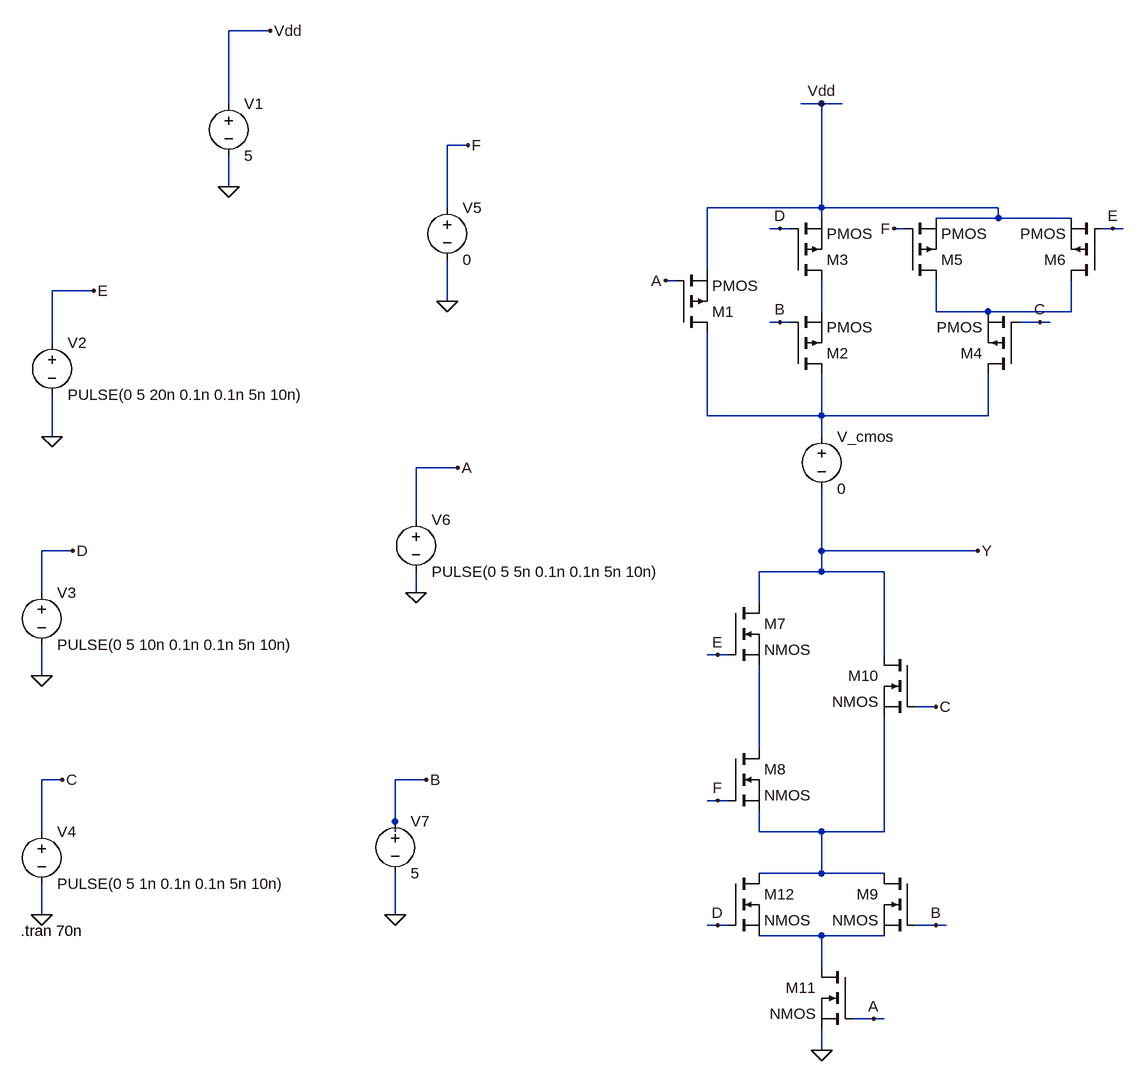
[diagram p0: schematic 5_2_1.asc]
5_2_1.asc, the LTspice schematic file:
Version 4
SHEET 1 1328 980
WIRE -368 -608 -432 -608
WIRE -432 -496 -432 -608
WIRE 480 -496 448 -496
WIRE 512 -496 480 -496
WIRE -64 -432 -96 -432
WIRE -432 -368 -432 -416
WIRE -96 -336 -96 -432
WIRE 480 -336 480 -496
WIRE 480 -336 304 -336
WIRE 752 -336 480 -336
WIRE 480 -320 480 -336
WIRE 752 -320 752 -336
WIRE 752 -320 656 -320
WIRE 864 -320 752 -320
WIRE 416 -304 400 -304
WIRE 432 -304 416 -304
WIRE 608 -304 592 -304
WIRE 928 -304 912 -304
WIRE 944 -304 928 -304
WIRE 304 -240 304 -336
WIRE 256 -224 240 -224
WIRE -640 -208 -704 -208
WIRE -96 -192 -96 -256
WIRE 480 -176 480 -224
WIRE 656 -176 656 -224
WIRE 736 -176 656 -176
WIRE 864 -176 864 -224
WIRE 864 -176 736 -176
WIRE 416 -160 400 -160
WIRE 432 -160 416 -160
WIRE 816 -160 784 -160
WIRE 832 -160 816 -160
WIRE -704 -128 -704 -208
WIRE 304 -16 304 -144
WIRE 480 -16 480 -80
WIRE 480 -16 304 -16
WIRE 736 -16 736 -80
WIRE 736 -16 480 -16
WIRE -704 16 -704 -48
WIRE 480 16 480 -16
WIRE -80 64 -144 64
WIRE -144 144 -144 64
WIRE -672 192 -720 192
WIRE 480 192 480 96
WIRE 720 192 480 192
WIRE 480 224 480 192
WIRE 480 224 384 224
WIRE 576 224 480 224
WIRE -720 256 -720 192
WIRE -144 256 -144 224
WIRE 384 272 384 224
WIRE 320 352 304 352
WIRE 336 352 320 352
WIRE 576 352 576 224
WIRE -720 384 -720 336
WIRE 656 432 624 432
WIRE 384 496 384 368
WIRE -688 544 -720 544
WIRE -128 544 -176 544
WIRE 320 576 304 576
WIRE 336 576 320 576
WIRE -176 608 -176 544
WIRE -720 624 -720 544
WIRE -176 624 -176 608
WIRE 384 624 384 592
WIRE 480 624 384 624
WIRE 576 624 576 448
WIRE 576 624 480 624
WIRE 480 688 480 624
WIRE 480 688 384 688
WIRE 576 688 480 688
WIRE -720 752 -720 704
WIRE -176 752 -176 688
WIRE 320 768 304 768
WIRE 336 768 320 768
WIRE 656 768 624 768
WIRE 672 768 656 768
WIRE 480 784 384 784
WIRE 576 784 480 784
WIRE 480 832 480 784
WIRE 560 912 528 912
WIRE 576 912 560 912
WIRE 480 960 480 928
FLAG 720 192 Y
FLAG 480 -496 Vdd
FLAG -368 -608 Vdd
FLAG -432 -368 0
FLAG -640 -208 E
FLAG -64 -432 F
FLAG -672 192 D
FLAG -80 64 A
FLAG -688 544 C
FLAG -128 544 B
FLAG -720 752 0
FLAG -176 752 0
FLAG -144 256 0
FLAG -720 384 0
FLAG -704 16 0
FLAG -96 -192 0
FLAG 480 960 0
FLAG 560 912 A
FLAG 240 -224 A
FLAG 656 768 B
FLAG 416 -160 B
FLAG 320 768 D
FLAG 416 -304 D
FLAG 656 432 C
FLAG 816 -160 C
FLAG 320 576 F
FLAG 592 -304 F
FLAG 320 352 E
FLAG 928 -304 E
SYMBOL nmos 336 272 R0
SYMATTR InstName M7
SYMBOL nmos 336 496 R0
SYMATTR InstName M8
SYMBOL nmos 624 352 M0
SYMATTR InstName M10
SYMBOL voltage -432 -512 R0
WINDOW 123 0 0 Left 0
WINDOW 39 0 0 Left 0
SYMATTR InstName V1
SYMATTR Value 5
SYMBOL voltage -704 -144 R0
WINDOW 123 0 0 Left 0
WINDOW 39 0 0 Left 0
SYMATTR InstName V2
SYMATTR Value PULSE(0 5 20n 0.1n 0.1n 5n 10n)
SYMBOL voltage -720 240 R0
WINDOW 123 0 0 Left 0
WINDOW 39 0 0 Left 0
SYMATTR InstName V3
SYMATTR Value PULSE(0 5 10n 0.1n 0.1n 5n 10n)
SYMBOL voltage -720 608 R0
WINDOW 123 0 0 Left 0
WINDOW 39 0 0 Left 0
SYMATTR InstName V4
SYMATTR Value PULSE(0 5 1n 0.1n 0.1n 5n 10n)
SYMBOL voltage -96 -352 R0
WINDOW 123 0 0 Left 0
WINDOW 39 0 0 Left 0
SYMATTR InstName V5
SYMATTR Value 0
SYMBOL voltage -144 128 R0
WINDOW 123 0 0 Left 0
WINDOW 39 0 0 Left 0
SYMATTR InstName V6
SYMATTR Value PULSE(0 5 5n 0.1n 0.1n 5n 10n)
SYMBOL voltage -176 592 R0
WINDOW 123 0 0 Left 0
WINDOW 39 0 0 Left 0
SYMATTR InstName V7
SYMATTR Value 5
SYMBOL nmos 624 688 M0
SYMATTR InstName M9
SYMBOL nmos 528 832 M0
SYMATTR InstName M11
SYMBOL nmos 336 688 R0
SYMATTR InstName M12
SYMBOL pmos 256 -144 M180
SYMATTR InstName M1
SYMBOL pmos 432 -80 M180
SYMATTR InstName M2
SYMBOL pmos 432 -224 M180
SYMATTR InstName M3
SYMBOL pmos 784 -80 R180
SYMATTR InstName M4
SYMBOL pmos 608 -224 M180
SYMATTR InstName M5
SYMBOL pmos 912 -224 R180
SYMATTR InstName M6
SYMBOL voltage 480 0 R0
WINDOW 123 0 0 Left 0
WINDOW 39 0 0 Left 0
SYMATTR InstName V_cmos
SYMATTR Value 0
TEXT -752 776 Left 2 !.tran 70n

The netlist it stands for:
* 5_2_1.asc
M7 Y E N004 N004 NMOS
M8 N004 F N005 N005 NMOS
M10 Y C N005 N005 NMOS
V1 Vdd 0 5
V2 E 0 PULSE(0 5 20n 0.1n 0.1n 5n 10n)
V3 D 0 PULSE(0 5 10n 0.1n 0.1n 5n 10n)
V4 C 0 PULSE(0 5 1n 0.1n 0.1n 5n 10n)
V5 F 0 0
V6 A 0 PULSE(0 5 5n 0.1n 0.1n 5n 10n)
V7 B 0 5
M9 N005 B N006 N006 NMOS
M11 N006 A 0 0 NMOS
M12 N005 D N006 N006 NMOS
M1 N003 A Vdd Vdd PMOS
M2 N003 B N001 N001 PMOS
M3 N001 D Vdd Vdd PMOS
M4 N003 C N002 N002 PMOS
M5 N002 F Vdd Vdd PMOS
M6 N002 E Vdd Vdd PMOS
V_cmos N003 Y 0
.model NMOS NMOS
.model PMOS PMOS
.lib standard.mos
.tran 70n
.backanno
.end